# Altium schematic sheet Teensy Brain Control.SchDoc: Teensy Control
size A4; Engineer: Jouveer Naidoo; DocumentNumber: 3; Revision: 1; SheetNumber: 1; SheetTotal: 4; ProjectIdentifier: Spin Up; SPICEModelCacheFPWZJBEA: <root> / <DocumentId>FPWZJBEA</DocumentId> / </root>
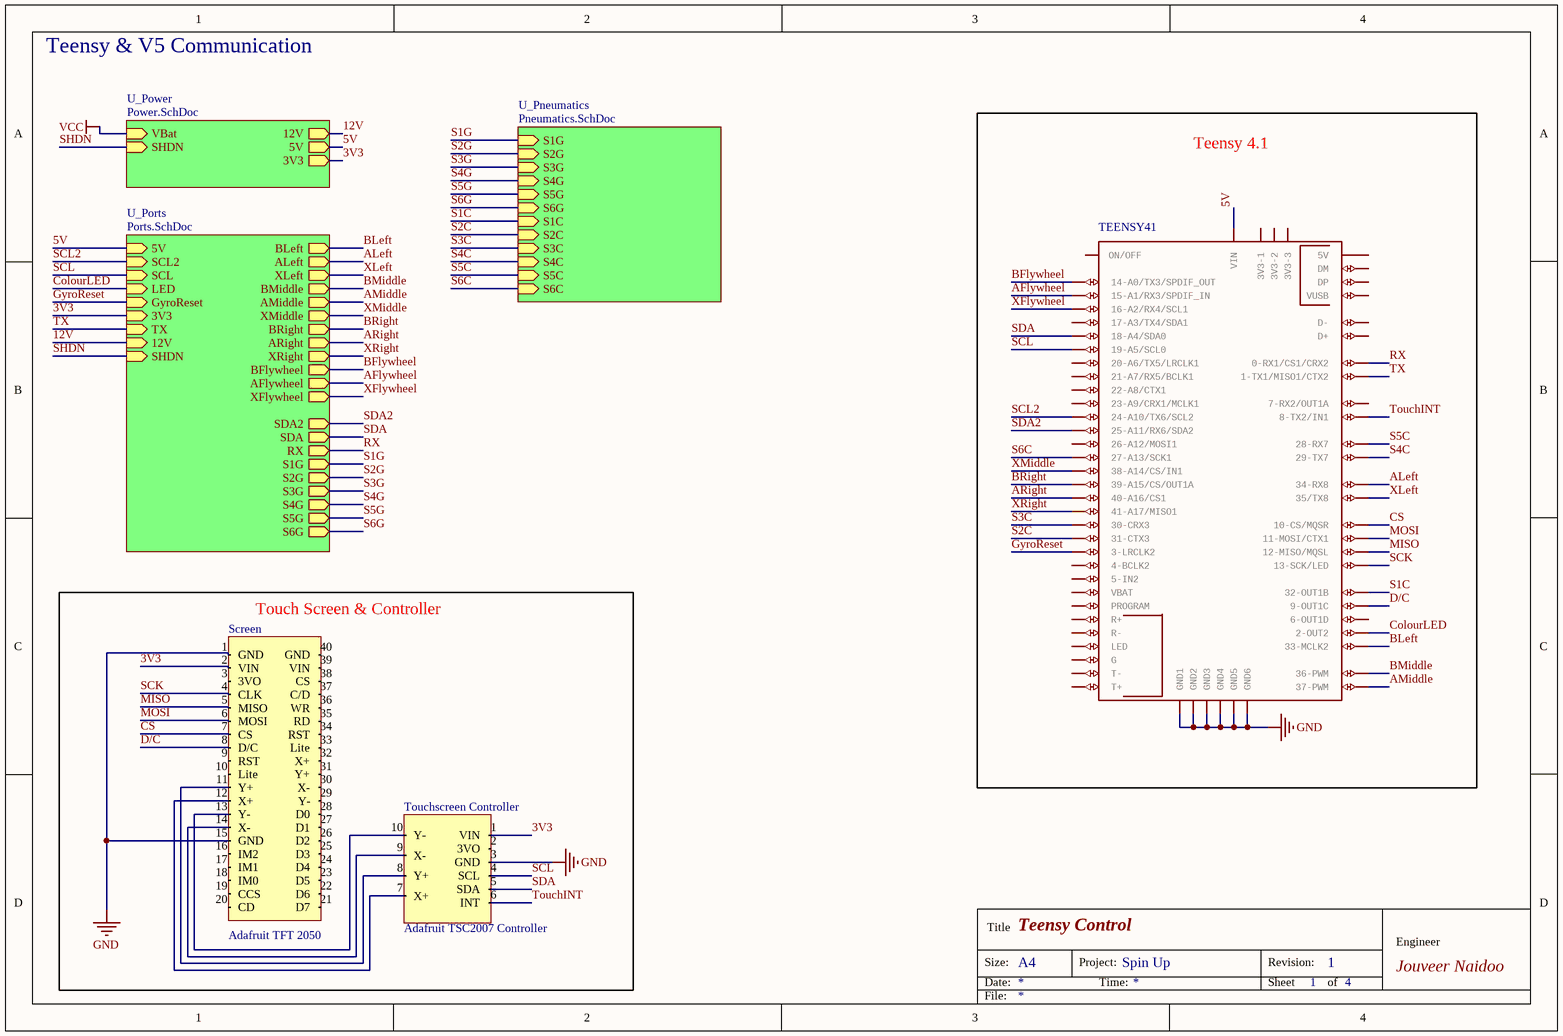
[diagram p0: Teensy Brain Control.SchDoc]

## Parts
Screen  Adafruit TFT 2050  [Adafruit TFT 2050-Footprint-1]
Teensy_4.1  TEENSY41  [TEENSY41]
Touchscreen_Controller  Adafruit TSC2007 Controller  [Adafruit TSC2007 Controller-Footprint-1]

## Blocks framed on the sheet
Teensy 4.1: Teensy_4.1
Touch Screen & Controller: Screen Touchscreen_Controller

## Sub-sheets
U_Pneumatics = Pneumatics.SchDoc: S1G (in), S2G (in), S3G (in), S4G (in), S5G (in), S1C (in), S2C (in), S3C (in), S4C (in), S5C (in), S6G (in), S6C (in)
U_Ports = Ports.SchDoc: 5V (in), BLeft (out), ALeft (out), XLeft (out), BMiddle (out), AMiddle (out), XMiddle (out), BRight (out), ARight (out), XRight (out), SCL (in), SDA (out), LED (in), GyroReset (in), 3V3 (in), TX (in), RX (out), 12V (in), S1G (out), S2G (out), S3G (out), S4G (out), S5G (out), S6G (out), BFlywheel (out), AFlywheel (out), XFlywheel (out), SHDN (in), SCL2 (in), SDA2 (out)
U_Power = Power.SchDoc: 12V (out), 5V (out), VBat (in), SHDN (in), 3V3 (out)

## Nets
GND: Screen.1(GND) Screen.15(GND) Teensy_4.1.GND1 Teensy_4.1.GND2 Teensy_4.1.GND3 Teensy_4.1.GND4 Teensy_4.1.GND5 Teensy_4.1.GND6 Touchscreen_Controller.3(GND)
VCC: sheet U_Power/VBat
3V3: Screen.2(VIN) Touchscreen_Controller.1(VIN) ; sheet U_Ports/3V3, sheet U_Power/3V3
5V: Teensy_4.1.VIN ; sheet U_Ports/5V, sheet U_Power/5V
12V: sheet U_Ports/12V, sheet U_Power/12V
AFlywheel: Teensy_4.1.15-A1/RX3/SPDIF_IN ; sheet U_Ports/AFlywheel
ALeft: Teensy_4.1.34-RX8 ; sheet U_Ports/ALeft
AMiddle: Teensy_4.1.37-PWM ; sheet U_Ports/AMiddle
ARight: Teensy_4.1.40-A16/CS1 ; sheet U_Ports/ARight
BFlywheel: Teensy_4.1.14-A0/TX3/SPDIF_OUT ; sheet U_Ports/BFlywheel
BLeft: Teensy_4.1.33-MCLK2 ; sheet U_Ports/BLeft
BMiddle: Teensy_4.1.36-PWM ; sheet U_Ports/BMiddle
BRight: Teensy_4.1.39-A15/CS/OUT1A ; sheet U_Ports/BRight
ColourLED: Teensy_4.1.2-OUT2 ; sheet U_Ports/LED
CS: Screen.7(CS) Teensy_4.1.10-CS\MQSR(10-CS/MQSR)
D/C: Screen.8(D/C) Teensy_4.1.9-OUT1C
GyroReset: Teensy_4.1.3-LRCLK2 ; sheet U_Ports/GyroReset
MISO: Screen.5(MISO) Teensy_4.1.12-MISO/MQSL
MOSI: Screen.6(MOSI) Teensy_4.1.11-MOSI/CTX1
RX: Teensy_4.1.0-RX1/CS1/CRX2 ; sheet U_Ports/RX
S1C: Teensy_4.1.32-OUT1B ; sheet U_Pneumatics/S1C
S1G: sheet U_Pneumatics/S1G, sheet U_Ports/S1G
S2C: Teensy_4.1.31-CTX3 ; sheet U_Pneumatics/S2C
S2G: sheet U_Pneumatics/S2G, sheet U_Ports/S2G
S3C: Teensy_4.1.30-CRX3 ; sheet U_Pneumatics/S3C
S3G: sheet U_Pneumatics/S3G, sheet U_Ports/S3G
S4C: Teensy_4.1.29-TX7 ; sheet U_Pneumatics/S4C
S4G: sheet U_Pneumatics/S4G, sheet U_Ports/S4G
S5C: Teensy_4.1.28-RX7 ; sheet U_Pneumatics/S5C
S5G: sheet U_Pneumatics/S5G, sheet U_Ports/S5G
S6C: Teensy_4.1.27-A13/SCK1 ; sheet U_Pneumatics/S6C
S6G: sheet U_Pneumatics/S6G, sheet U_Ports/S6G
SCK: Screen.4(CLK) Teensy_4.1.13-SCK/LED
SCL: Teensy_4.1.19-A5/SCL0 Touchscreen_Controller.4(SCL) ; sheet U_Ports/SCL
SCL2: Teensy_4.1.24-A10/TX6/SCL2 ; sheet U_Ports/SCL2
SDA: Teensy_4.1.18-A4/SDA0 Touchscreen_Controller.5(SDA) ; sheet U_Ports/SDA
SDA2: Teensy_4.1.25-A11/RX6/SDA2 ; sheet U_Ports/SDA2
SHDN: sheet U_Ports/SHDN, sheet U_Power/SHDN
TouchINT: Teensy_4.1.8-TX2/IN1 Touchscreen_Controller.6(INT)
TX: Teensy_4.1.1-TX1/MISO1/CTX2 ; sheet U_Ports/TX
XFlywheel: Teensy_4.1.16-A2/RX4/SCL1 ; sheet U_Ports/XFlywheel
XLeft: Teensy_4.1.35-TX8(35/TX8) ; sheet U_Ports/XLeft
XMiddle: Teensy_4.1.38-A14/CS/IN1 ; sheet U_Ports/XMiddle
XRight: Teensy_4.1.41-A17/MISO1 ; sheet U_Ports/XRight
NetScreen_11: Screen.11(Y+) Touchscreen_Controller.8(Y+)
NetScreen_12: Screen.12(X+) Touchscreen_Controller.7(X+)
NetScreen_13: Screen.13(Y-) Touchscreen_Controller.10(Y-)
NetScreen_14: Screen.14(X-) Touchscreen_Controller.9(X-)

Not connected (* = marked no-connect by the designer): Screen 3(3VO) 9(RST) 10(Lite) 16(IM2) 17(IM1) 18(IM0) 19(CCS) 20(CD) 21(D7) 22(D6) 23(D5) 24(D4) 25(D3) 26(D2) 27(D1) 28(D0) 29(Y-) 30(X-) 31(Y+) 32(X+) 33(Lite) 34(RST) 35(RD) 36(WR) 37(C/D) 38(CS) 39(VIN) 40(GND); Teensy_4.1 3V3-1 3V3-2 3V3-3 4-BCLK2 5-IN2 6-OUT1D 7-RX2/OUT1A 17-A3/TX4/SDA1 20-A6/TX5/LRCLK1 21-A7/RX5/BCLK1 22-A8/CTX1 23-A9/CRX1/MCLK1 26-A12/MOSI1 +5V(5V) D+ D- DM DP G LED ON/OFF PROGRAM R+ R- T+ T- VBAT VUSB; Touchscreen_Controller 2(3VO)

## Notes on the sheet
- Teensy & V5 Communication
- Size:
- Date:
- Title
- A4
- Project:
- Time:
- Revision:
- Sheet
- of
- Engineer
- File:

## Library data of the parts
Screen = CMP-001-0000-2
Teensy_4.1 = CMP-013-000002-2: Teensy 4.1 Development Board; GateName_1: G$1; Evaluation Kit: Yes; Core Architecture: ARM; DeviceSetName: TEENSY41; Design Item ID: TEENSY41; Source: teensy.SCHLIB; SymbolName_1: TEENSY41; LibraryName: teensy; Package: TEENSY41; Series: i.MX
Touchscreen_Controller = CMP-015-00009-3